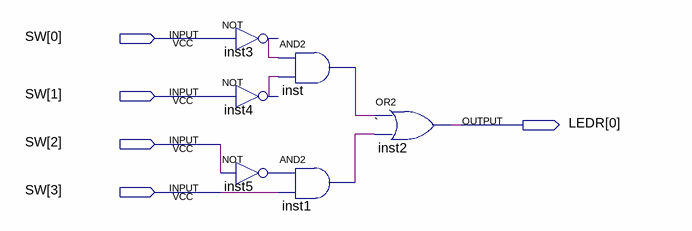
[diagram p0: schematic sheet]
// Quartus schematic Lab1_Part2_Schematic.bdf as structural Verilog: 6 symbols, 5 pins
module Lab1_Part2_Schematic (
  input  [3:0] SW,
  output [0:0] LEDR
);

  wire \` , inst3_out, inst4_out, inst5_out, inst_out;

  not inst3 (inst3_out, SW[0]);
  and inst (inst_out, inst3_out, inst4_out);
  not inst4 (inst4_out, SW[1]);
  and inst1 (\` , inst5_out, SW[3]);
  not inst5 (inst5_out, SW[2]);
  or inst2 (LEDR[0], inst_out, \` );
endmodule
